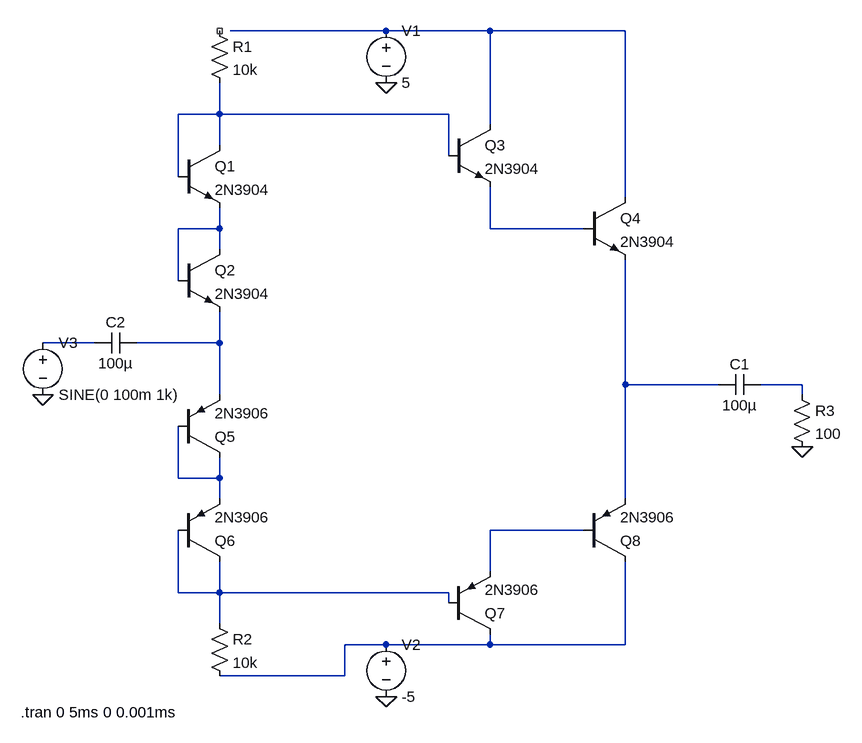
[diagram p0: schematic Az6 part 3.asc]
Az6 part 3.asc, the LTspice schematic file:
Version 4
SHEET 1 1172 952
WIRE 464 -112 224 -112
WIRE 624 -112 464 -112
WIRE 832 -112 624 -112
WIRE 208 16 208 -32
WIRE 208 16 144 16
WIRE 560 16 208 16
WIRE 624 32 624 -112
WIRE 208 64 208 16
WIRE 560 80 560 16
WIRE 144 112 144 16
WIRE 832 144 832 -112
WIRE 208 192 208 160
WIRE 208 192 144 192
WIRE 624 192 624 128
WIRE 768 192 624 192
WIRE 208 224 208 192
WIRE 144 272 144 192
WIRE 16 368 -64 368
WIRE 208 368 208 320
WIRE 208 368 80 368
WIRE 832 432 832 240
WIRE 976 432 832 432
WIRE 1104 432 1040 432
WIRE 208 448 208 368
WIRE 1104 448 1104 432
WIRE 144 576 144 496
WIRE 208 576 208 544
WIRE 208 576 144 576
WIRE 208 608 208 576
WIRE 832 608 832 432
WIRE 768 656 624 656
WIRE 624 720 624 656
WIRE 144 752 144 656
WIRE 208 752 208 704
WIRE 208 752 144 752
WIRE 560 752 208 752
WIRE 560 768 560 752
WIRE 208 800 208 752
WIRE 464 832 400 832
WIRE 624 832 624 816
WIRE 624 832 464 832
WIRE 832 832 832 704
WIRE 832 832 624 832
WIRE 400 880 400 832
WIRE 400 880 208 880
FLAG -64 448 0
FLAG 464 -32 0
FLAG 464 912 0
FLAG 1104 528 0
SYMBOL npn 144 64 R0
SYMATTR InstName Q1
SYMATTR Value 2N3904
SYMBOL npn 144 224 R0
SYMATTR InstName Q2
SYMATTR Value 2N3904
SYMBOL npn 560 32 R0
SYMATTR InstName Q3
SYMATTR Value 2N3904
SYMBOL npn 768 144 R0
SYMATTR InstName Q4
SYMATTR Value 2N3904
SYMBOL pnp 144 544 M180
SYMATTR InstName Q5
SYMATTR Value 2N3906
SYMBOL pnp 144 704 M180
SYMATTR InstName Q6
SYMATTR Value 2N3906
SYMBOL pnp 560 816 M180
SYMATTR InstName Q7
SYMATTR Value 2N3906
SYMBOL pnp 768 704 M180
SYMATTR InstName Q8
SYMATTR Value 2N3906
SYMBOL res 192 -128 R0
SYMATTR InstName R1
SYMATTR Value 10k
SYMBOL res 192 784 R0
SYMATTR InstName R2
SYMATTR Value 10k
SYMBOL res 1088 432 R0
SYMATTR InstName R3
SYMATTR Value 100
SYMBOL cap 1040 416 R90
WINDOW 0 0 32 VBottom 2
WINDOW 3 32 32 VTop 2
SYMATTR InstName C1
SYMATTR Value 100µ
SYMBOL voltage 464 -128 R0
SYMATTR InstName V1
SYMATTR Value 5
SYMBOL voltage 464 816 R0
SYMATTR InstName V2
SYMATTR Value -5
SYMBOL cap 80 352 R90
WINDOW 0 0 32 VBottom 2
WINDOW 3 32 32 VTop 2
SYMATTR InstName C2
SYMATTR Value 100µ
SYMBOL voltage -64 352 R0
WINDOW 123 0 0 Left 0
WINDOW 39 0 0 Left 0
SYMATTR InstName V3
SYMATTR Value SINE(0 100m 1k)
TEXT -98 936 Left 2 !.tran 0 5ms 0 0.001ms

The netlist it stands for:
* Az6 part 3.asc
Q1 N002 N002 N003 0 2N3904
Q2 N003 N003 N006 0 2N3904
Q3 N001 N002 N004 0 2N3904
Q4 N001 N004 N007 0 2N3904
Q5 N009 N009 N006 0 2N3906
Q6 N011 N011 N009 0 2N3906
Q7 N012 N011 N010 0 2N3906
Q8 N012 N010 N007 0 2N3906
R1 NC_01 N002 10k
R2 N011 N012 10k
R3 N008 0 100
C1 N008 N007 100µ
V1 N001 0 5
V2 N012 0 -5
C2 N006 N005 100µ
V3 N005 0 SINE(0 100m 1k)
.model NPN NPN
.model PNP PNP
.lib standard.bjt
.tran 0 5ms 0 0.001ms
.backanno
.end